# EAGLE design AtmelZLLBoard (EAGLE 7.7.0)
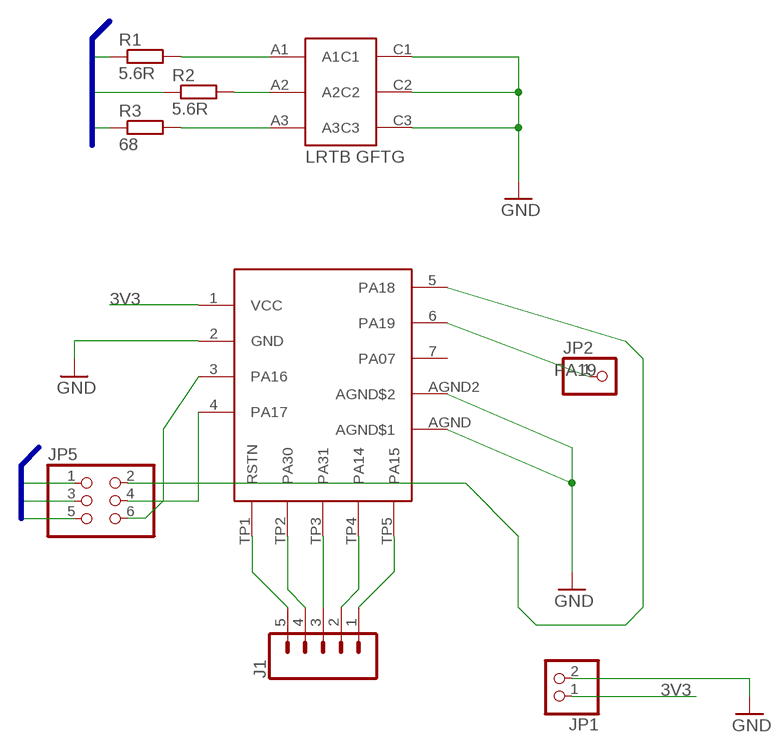
[diagram p0: schematic, sheet 1]

## Parts
J1  CONN_05LOCK  [1X05_LOCK]
JP1  PINHD-1X2  [1X02]
JP2  PINHD-1X1  [1X01]
JP5  PINHD-2X3  [2X03]
R1  5.6R  R-EU_0204/5  [0204/5]
R2  5.6R  R-EU_0204/5  [0204/5]
R3  68  R-EU_0204/5  [0204/5]
U$1  ATSAMR21B18-MZ210PA-DEV  [ATSAMR21B18-MZ210PA-DEV]
U$2  LRTB_GFTG  [LRTB_GFTG]

## Nets
3V3: JP1.1 U$1.1(VCC)
B: JP5.1 R1.1
G: JP5.3 R2.1
GND: JP1.2 U$1.2(GND) U$1.AGND2(AGND$2) U$1.AGND(AGND$1) U$2.C1 U$2.C2 U$2.C3
N$1: J1.5 U$1.TP1(RSTN)
N$2: R1.2 U$2.A1
N$3: R2.2 U$2.A2
N$4: R3.2 U$2.A3
N$5: JP5.4 U$1.4(PA17)
N$6: JP5.2 U$1.5(PA18)
N$7: JP5.6 U$1.3(PA16)
N$8: J1.4 U$1.TP2(PA30)
N$9: J1.3 U$1.TP3(PA31)
N$10: J1.2 U$1.TP4(PA14)
N$11: J1.1 U$1.TP5(PA15)
PA19: JP2.1 U$1.6(PA19)
R: JP5.5 R3.1
Unconnected: U$1.7(PA07)

## Buses
RGB,R,G,B
B,G,R

## Library data of the parts
J1 = SparkFun-Connectors:CONN_05: Multi connection point. Often used as Generic Header-pin footprint for 0.1 inch spaced/style header connections On any of the 0.1 inch spaced packages, you can populate with these: Break Away Headers - Straight <https://www.sparkfun.com/products/116> (PRT-00116) Break Away Male Headers - Right Angle <https://www.sparkfun.com/products/553> (PRT-00553) Female Headers <https://www.sparkfun.com/products/115> (PRT-00115) Break Away Headers - Machine Pin <https://www.sparkfun.com/products/117> (PRT-00117) Break Away Female Headers - Swiss Machine Pin <https://www.sparkfun.com/products/743> (PRT-00743) For SCREWTERMINALS and SPRING TERMINALS visit here: Screw Terimnals on SparkFun.com <https://www.sparkfun.com/search/results?term=Screw+Terminals> (5mm/3.5mm/2.54mm spacing) This device is also useful as a general connection point to wire up your design to another part of your project. Our various solder wires solder well into these plated through hole pads. Hook-Up Wire - Assortment (Stranded, 22 AWG) <https://www.sparkfun.com/products/11375> (PRT-11375) Hook-Up Wire - Assortment (Solid Core, 22 AWG) <https://www.sparkfun.com/products/11367> (PRT-11367) View the entire wire category on our website here <https://www.sparkfun.com/categories/141> Special notes: Molex polarized connector foot print use with SKU : PRT-08231 with associated crimp pins and housings. 1MM SMD Version SKU: PRT-10208
JP1 = pinhead:PINHD-1X2: PIN HEADER
JP2 = pinhead:PINHD-1X1: PIN HEADER
JP5 = pinhead:PINHD-2X3: PIN HEADER
R1-R3 = resistor:R-EU_: RESISTOR, European symbol
U$1 = atmel-zll:ATSAMR21B18-MZ210PA-DEV
U$2 = osram_led:LRTB_GFTG

## Board
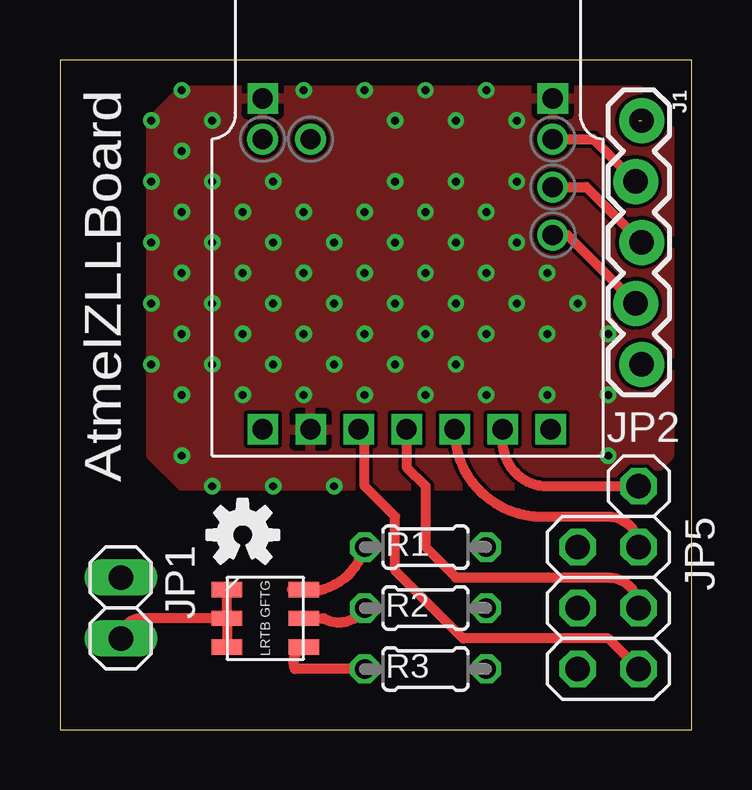
[diagram p1: board, top side]
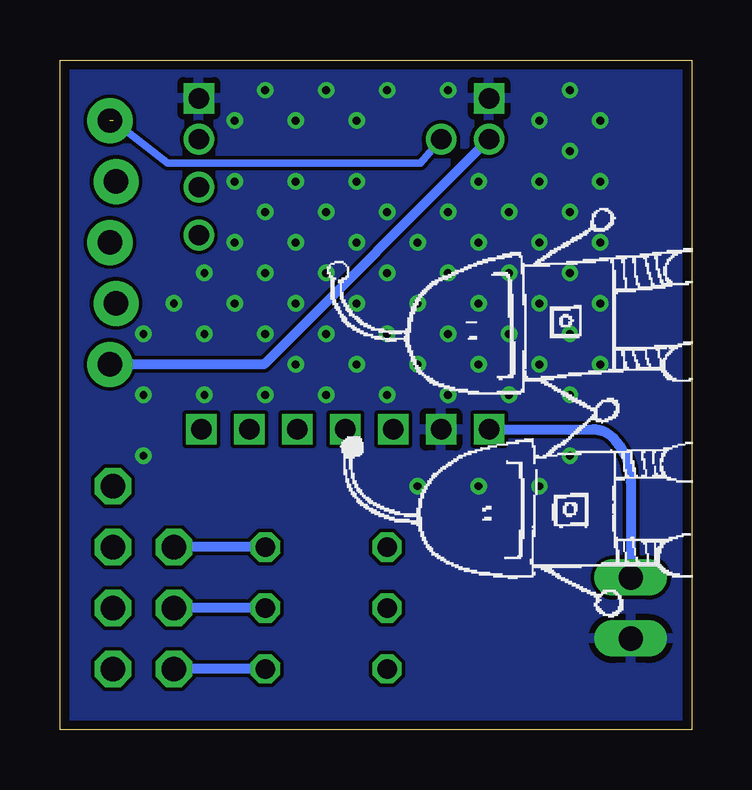
[diagram p2: board, bottom side, seen from below]

Size 26.34 x 27.93 mm. Coordinates in mm from the lower left corner, seen from the top.
Outline: 0,0 26.34,0 26.34,27.93 0,27.93 0,0
Copper layers (1*16): Top 0.0356mm / dielectric 1.5011mm / Bottom 0.0356mm
Design rules "oshpark-2layer": minimum track width 6mil, minimum drill 13mil, track to track 6mil, track to pad 6mil, pad to pad 6mil, via to via 6mil, smd to smd 6mil, copper to edge 15mil, drill to drill 6mil, minimum pad ring 7mil, minimum via ring 7mil, stop-mask expansion 2.5mil, vias tented up to drill 0mil, thermal gap 10mil

### Footprints (pad centres in the part's own frame; a part is rotated, then mirrored left to right if it is on the bottom)
1X05_LOCK = drill 1.016 pad 1.88: 1 0,0.127; 2 2.54,-0.127; 3 5.08,0.127; 4 7.62,-0.127; 5 10.16,0.127
1X02 = drill 1.016 long: 1 -1.27,0; 2 1.27,0
1X01 = drill 1.016 octagon: 1 0,0
2X03 = drill 1.016 octagon: 1 -2.54,-1.27; 2 -2.54,1.27; 3 0,-1.27; 4 0,1.27; 5 2.54,-1.27; 6 2.54,1.27
0204/5 = drill 0.813 octagon: 1 -2.54,0; 2 2.54,0
ATSAMR21B18-MZ210PA-DEV = drill 0.85 square: 1 2.1,1.1; 2 4.1,1.1; 3 6.1,1.1; 4 8.1,1.1; 5 10.1,1.1; 6 12.1,1.1; 7 14.1,1.1; AGND 2.1,14.9; AGND2 14.2,14.9 | drill 0.85 pad 1.27: TP1 2.1,13.2; TP2 14.2,9.2; TP3 14.2,11.2; TP4 14.2,13.2; TP5 4.1,13.2
LRTB_GFTG = smd 0.635 x 1.27: A1 0.5,0; A2 1.7,0; A3 2.9,0; C1 0.5,-3.2; C2 1.7,-3.2; C3 2.9,-3.2

### Placement (x,y rotation side)
J1  24.13,25.4 270 top
JP1  2.54,5.08 270 top
JP2  24.13,10.16 0 top
JP5  22.86,5.08 270 top
R1  15.24,7.62 180 top
R2  15.24,5.08 180 top
R3  15.24,2.54 180 top
U$1  6.35,11.43 0 top
U$2  10.16,6.35 270 top
U$3  [OSHW-LOGO-S]  7.62,8.13 0 top
U$4  [TIWTIE_LOGO]  0,3.81 90 bottom

### Tracks (layer width: path | path; a pad name or v marks a point on that pad's centre or on a via)
3V3
  Bottom 0.406: U$1.1 4.1,12.53 arc45 3.31,12.2 arc45 2.54,10.34 JP1.1
B
  Bottom 0.406: R1.1 JP5.1
G
  Bottom 0.406: R2.1 JP5.3
GND  (via drill 0.33, 0.33 pad 0.42)
  Top 0.406: U$2.C2 3.38,4.65 arc90 JP1.2 | U$2.C2 U$2.C3 | U$2.C2 U$2.C1
  other vias: 3.81,25.4 3.81,20.32 6.35,10.16 3.81,22.86 3.81,17.78 3.81,15.24 8.89,10.16 11.43,10.16 22.86,16.51 5.08,24.13 5.08,21.59 5.08,19.05 5.08,16.51 5.08,13.97 5.08,11.43 6.35,22.86 6.35,25.4 7.62,21.59 6.35,20.32 7.62,19.05 6.35,17.78 7.62,16.51 6.35,15.24 13.97,25.4 16.51,25.4 19.05,25.4 19.05,20.32 20.32,19.05 19.05,17.78 20.32,16.51 21.59,17.78 22.86,13.97 22.86,11.43 20.32,13.97 17.78,13.97 15.24,13.97 12.7,13.97 10.16,13.97 7.62,13.97 12.7,16.51 10.16,16.51 8.89,17.78 8.89,20.32 8.89,22.86 10.16,21.59 10.16,19.05 11.43,17.78 12.7,19.05 15.24,21.59 16.51,20.32 17.78,21.59 17.78,19.05 8.89,15.24 11.43,15.24 13.97,15.24 13.97,17.78 15.24,16.51 16.51,15.24 11.43,20.32 13.97,20.32 15.24,19.05 16.51,17.78 17.78,16.51 12.7,21.59 13.97,22.86 16.51,22.86 19.05,22.86 12.7,26.67 15.24,26.67 17.78,26.67 10.16,26.67 5.08,26.67
  pour Top: 3.81,25.4 5.08,26.67 24.13,26.67 25.4,25.4 25.4,11.43 24.13,10.16 5.08,10.16 3.81,11.43
  pour Bottom: 0,27.94 26.67,27.94 26.67,0 0,0
N$1
  Bottom 0.406: U$1.TP1 17.84,15.24 J1.5
N$2
  Top 0.406: U$2.A1 9.66,5.85 arc90 R1.2
N$3
  Top 0.406: U$2.A2 11,4.65 arc90 R2.2
N$4
  Top 0.406: R3.2 9.8,2.54 arc-90 U$2.A3
N$5
  Top 0.406: JP5.4 arc90 22.86,6.35 16.51,6.35 15.24,7.62 15.24,10.16 14.45,10.95 U$1.4
N$6
  Top 0.406: U$1.5 arc90 20.09,8.89 22.86,8.89 arc-90 JP5.2
N$7
  Top 0.406: JP5.6 22.86,3.81 16.81,3.81 13.97,6.65 13.97,8.89 12.7,10.16 12.7,12.28 U$1.3
N$8
  Top 0.406: U$1.TP2 21.15,20.63 J1.4
N$9
  Top 0.406: U$1.TP3 21.95,22.63 J1.3
N$10
  Top 0.406: U$1.TP4 22.23,24.63 J1.2
N$11  (1 unrouted)
  Bottom 0.305: 24.13,25.4 21.84,23.62 11.31,23.62 U$1.TP5
PA19
  Top 0.406: U$1.6 18.45,12.03 arc90 20.32,10.16 JP2.1
R
  Bottom 0.406: R3.1 JP5.5

### Text on the board
_tsilk: AtmelZLLBoard